# Altium schematic sheet pca10090_sheet1_connections.SchDoc: PCA10090 - Connections
size A3; Organization: Nordic Semiconductor; DocumentNumber: 1; SheetNumber: 1; SheetTotal: 8; CompanyName: Nordic Semiconductor; DocumentSize: A4
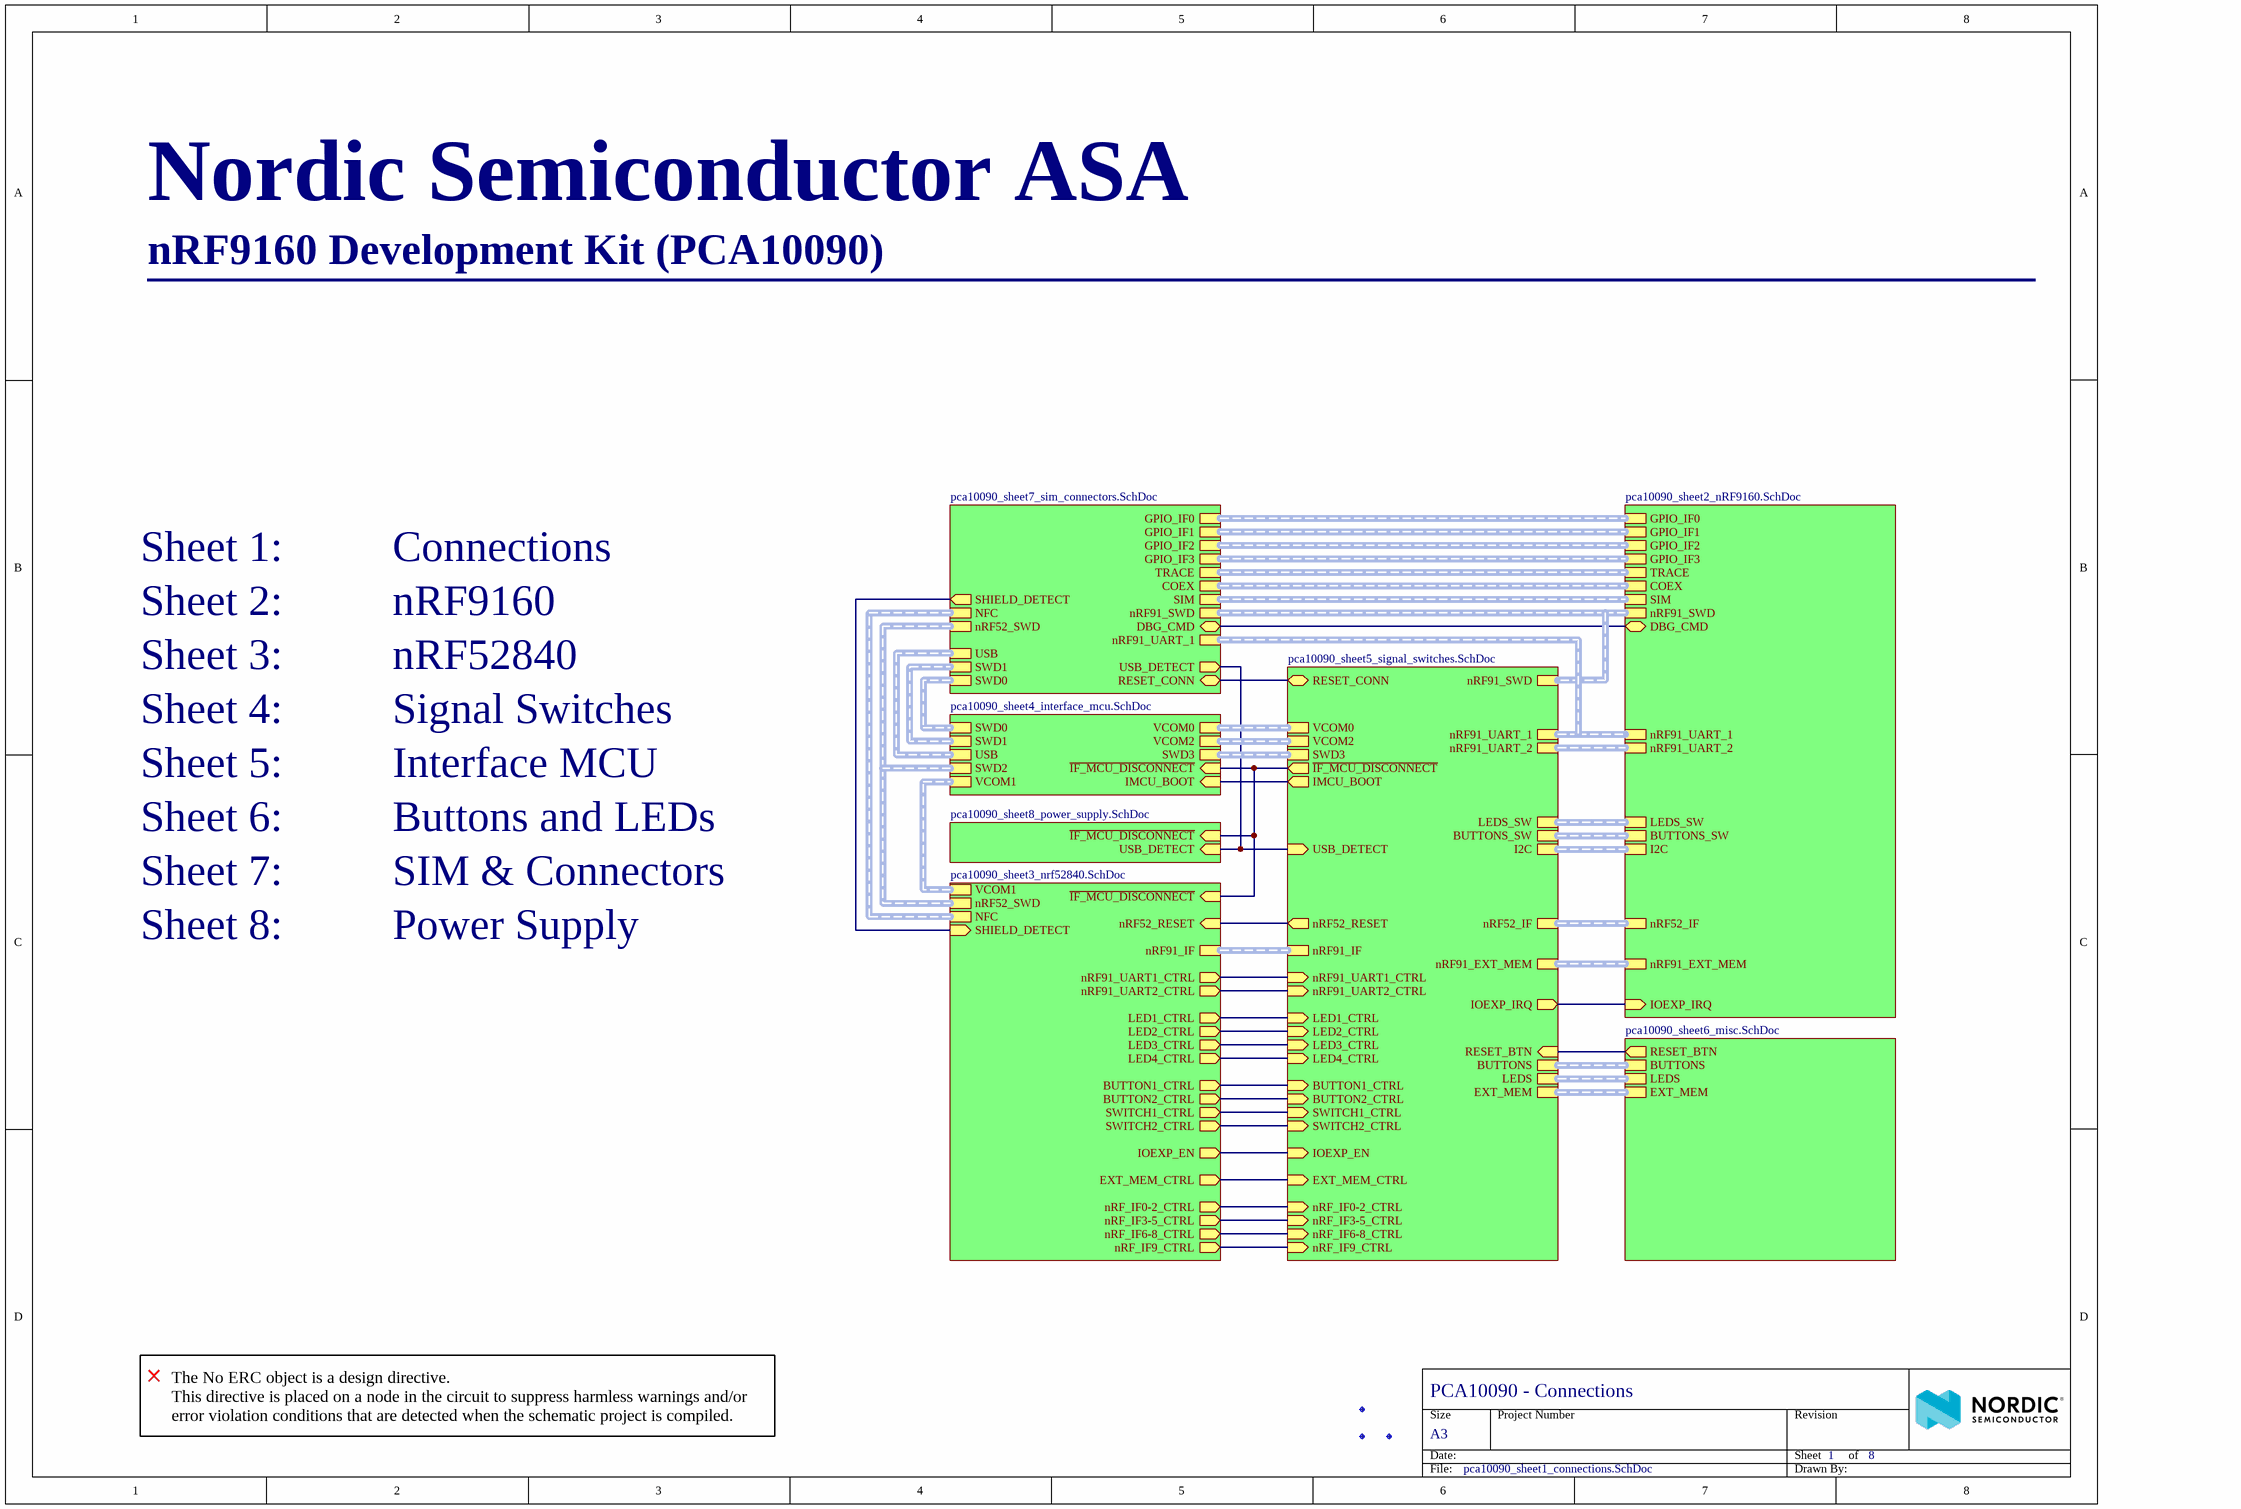
[diagram p0: pca10090_sheet1_connections.SchDoc]

## Parts
Fid1  Fiducial mark  [Fiducial]  (value not drawn)
Fid2  Fiducial mark  [Fiducial]  (value not drawn)
Fid3  Fiducial mark  [Fiducial]  (value not drawn)

## Sub-sheets
? = pca10090_sheet2_nRF9160.SchDoc: nRF91_SWD (harness SWD), DBG_CMD (bidir), nRF91_UART_1 (harness UART), COEX (harness COEX), nRF91_UART_2 (harness UART), SIM (harness SIM), I2C (harness I2C), GPIO_IF1 (harness GPIO_IF1), GPIO_IF0 (harness GPIO_IF0), GPIO_IF2 (harness GPIO_IF2), GPIO_IF3 (harness GPIO_IF3), TRACE (harness TRACE), BUTTONS_SW (harness UI), LEDS_SW (harness UI), nRF52_IF (harness nRF_IF), IOEXP_IRQ (in), nRF91_EXT_MEM (harness MEMORY)
? = pca10090_sheet3_nrf52840.SchDoc: BUTTON1_CTRL (out), nRF_IF0-2_CTRL (out), nRF91_UART2_CTRL (out), LED4_CTRL (out), LED3_CTRL (out), nRF_IF6-8_CTRL (out), nRF_IF3-5_CTRL (out), SWITCH1_CTRL (out), ~{IF_MCU_DISCONNECT} (in), SHIELD_DETECT (in), VCOM1 (harness UART), LED1_CTRL (out), LED2_CTRL (out), SWITCH2_CTRL (out), BUTTON2_CTRL (out), NFC (harness NFC), nRF91_IF (harness nRF_IF), nRF91_UART1_CTRL (out), nRF52_SWD (harness SWD), IOEXP_EN (out), nRF52_RESET (in), nRF_IF9_CTRL (out), EXT_MEM_CTRL (out)
? = pca10090_sheet4_interface_mcu.SchDoc: VCOM1 (harness UART), VCOM0 (harness UART), VCOM2 (harness UART), ~{IF_MCU_DISCONNECT} (in), IMCU_BOOT (in), SWD3 (harness SWD), SWD1 (harness SWD), USB (harness USB), SWD0 (harness SWD), SWD2 (harness SWD)
? = pca10090_sheet5_signal_switches.SchDoc: LED2_CTRL (in), ~{IF_MCU_DISCONNECT} (out), nRF52_IF (harness nRF_IF), BUTTONS (harness UI), VCOM2 (harness UART), RESET_BTN (in), nRF91_SWD (harness SWD), VCOM0 (harness UART), BUTTON2_CTRL (in), BUTTON1_CTRL (in), SWD3 (harness SWD), nRF_IF3-5_CTRL (in), nRF91_UART_1 (harness UART), nRF91_UART_2 (harness UART), nRF91_UART1_CTRL (in), LED1_CTRL (in), IMCU_BOOT (out), LEDS (harness UI), nRF_IF6-8_CTRL (in), nRF91_UART2_CTRL (in), LED3_CTRL (in), LED4_CTRL (in), SWITCH2_CTRL (in), nRF_IF0-2_CTRL (in), SWITCH1_CTRL (in), RESET_CONN (bidir), USB_DETECT (in), I2C (harness I2C), LEDS_SW (harness UI), BUTTONS_SW (harness UI), nRF91_IF (harness nRF_IF), IOEXP_EN (in), IOEXP_IRQ (out), nRF52_RESET (out), nRF_IF9_CTRL (in), nRF91_EXT_MEM (harness MEMORY), EXT_MEM_CTRL (in), EXT_MEM (harness MEMORY)
? = pca10090_sheet6_misc.SchDoc: BUTTONS (harness UI), LEDS (harness UI), RESET_BTN (out), EXT_MEM (harness MEMORY)
? = pca10090_sheet7_sim_connectors.SchDoc: NFC (harness NFC), COEX (harness COEX), nRF91_SWD (harness SWD), DBG_CMD (bidir), GPIO_IF3 (harness GPIO_IF3), GPIO_IF0 (harness GPIO_IF0), TRACE (harness TRACE), USB_DETECT (out), USB (harness USB), SIM (harness SIM), nRF52_SWD (harness SWD), GPIO_IF1 (harness GPIO_IF1), GPIO_IF2 (harness GPIO_IF2), SWD0 (harness SWD), SWD1 (harness SWD), RESET_CONN (bidir), SHIELD_DETECT (out), nRF91_UART_1 (harness UART)
? = pca10090_sheet8_power_supply.SchDoc: ~{IF_MCU_DISCONNECT} (in), USB_DETECT (in)

## Nets
(unnamed): sheet /DBG_CMD, sheet /DBG_CMD
(unnamed): sheet /IOEXP_IRQ, sheet /IOEXP_IRQ
(unnamed): sheet /BUTTON1_CTRL, sheet /BUTTON1_CTRL
(unnamed): sheet /nRF_IF0-2_CTRL, sheet /nRF_IF0-2_CTRL
(unnamed): sheet /nRF91_UART2_CTRL, sheet /nRF91_UART2_CTRL
(unnamed): sheet /LED4_CTRL, sheet /LED4_CTRL
(unnamed): sheet /LED3_CTRL, sheet /LED3_CTRL
(unnamed): sheet /nRF_IF6-8_CTRL, sheet /nRF_IF6-8_CTRL
(unnamed): sheet /nRF_IF3-5_CTRL, sheet /nRF_IF3-5_CTRL
(unnamed): sheet /SWITCH1_CTRL, sheet /SWITCH1_CTRL
(unnamed): sheet /~{IF_MCU_DISCONNECT}, sheet /~{IF_MCU_DISCONNECT}, sheet /~{IF_MCU_DISCONNECT}, sheet /~{IF_MCU_DISCONNECT}
(unnamed): sheet /SHIELD_DETECT, sheet /SHIELD_DETECT
(unnamed): sheet /LED1_CTRL, sheet /LED1_CTRL
(unnamed): sheet /LED2_CTRL, sheet /LED2_CTRL
(unnamed): sheet /SWITCH2_CTRL, sheet /SWITCH2_CTRL
(unnamed): sheet /BUTTON2_CTRL, sheet /BUTTON2_CTRL
(unnamed): sheet /nRF91_UART1_CTRL, sheet /nRF91_UART1_CTRL
(unnamed): sheet /IOEXP_EN, sheet /IOEXP_EN
(unnamed): sheet /nRF52_RESET, sheet /nRF52_RESET
(unnamed): sheet /nRF_IF9_CTRL, sheet /nRF_IF9_CTRL
(unnamed): sheet /EXT_MEM_CTRL, sheet /EXT_MEM_CTRL
(unnamed): sheet /IMCU_BOOT, sheet /IMCU_BOOT
(unnamed): sheet /RESET_BTN, sheet /RESET_BTN
(unnamed): sheet /RESET_CONN, sheet /RESET_CONN
(unnamed): sheet /USB_DETECT, sheet /USB_DETECT, sheet /USB_DETECT

## Buses and harness runs
harness sheet /nRF52_SWD = sheet /SWD2

## Notes on the sheet
- Nordic Semiconductor ASA
- nRF9160 Development Kit (PCA10090)
- ________________________________________________________________
- Sheet 1:          Connections
- Sheet 2:          nRF9160
- Sheet 3:          nRF52840
- Sheet 4:          Signal Switches
- Sheet 5:          Interface MCU
- Sheet 6:          Buttons and LEDs
- Sheet 7:          SIM & Connectors
- Sheet 8:          Power Supply
- The No ERC object is a design directive.
  This directive is placed on a node in the circuit to suppress harmless warnings and/or error violation conditions that are detected when the schematic project is compiled.
- Size
- Date:
- A3
- Project Number
- Sheet         of
- Revision
- File:
- Drawn By:

## Library data of the parts
Fid1-Fid3 = Fid-Mark: Artikkelnr Noca: N.A.; Part Number: Fid-Mark; Manufacturer: *; Manufacturer Part Number: *; LatestRevisionDate: 2009-12-12; Pin Count: 1; Publisher: Nordic Semiconductor; Published: 2009-12-12; Value: *; Note: *; Footprint Doc: Fiducial; Part number IPS: N.A.; ComponentLink1URL: *; ComponentLink1Description: Datasheet; ComponentLink2URL: *; ComponentLink2Description: Supplier link; HelpURL: *; Supplier 1: *; Supplier Part Number 1: *; Supplier 2: *; Supplier Part Number 2: *